# Altium schematic sheet Power block.SchDoc
size A4
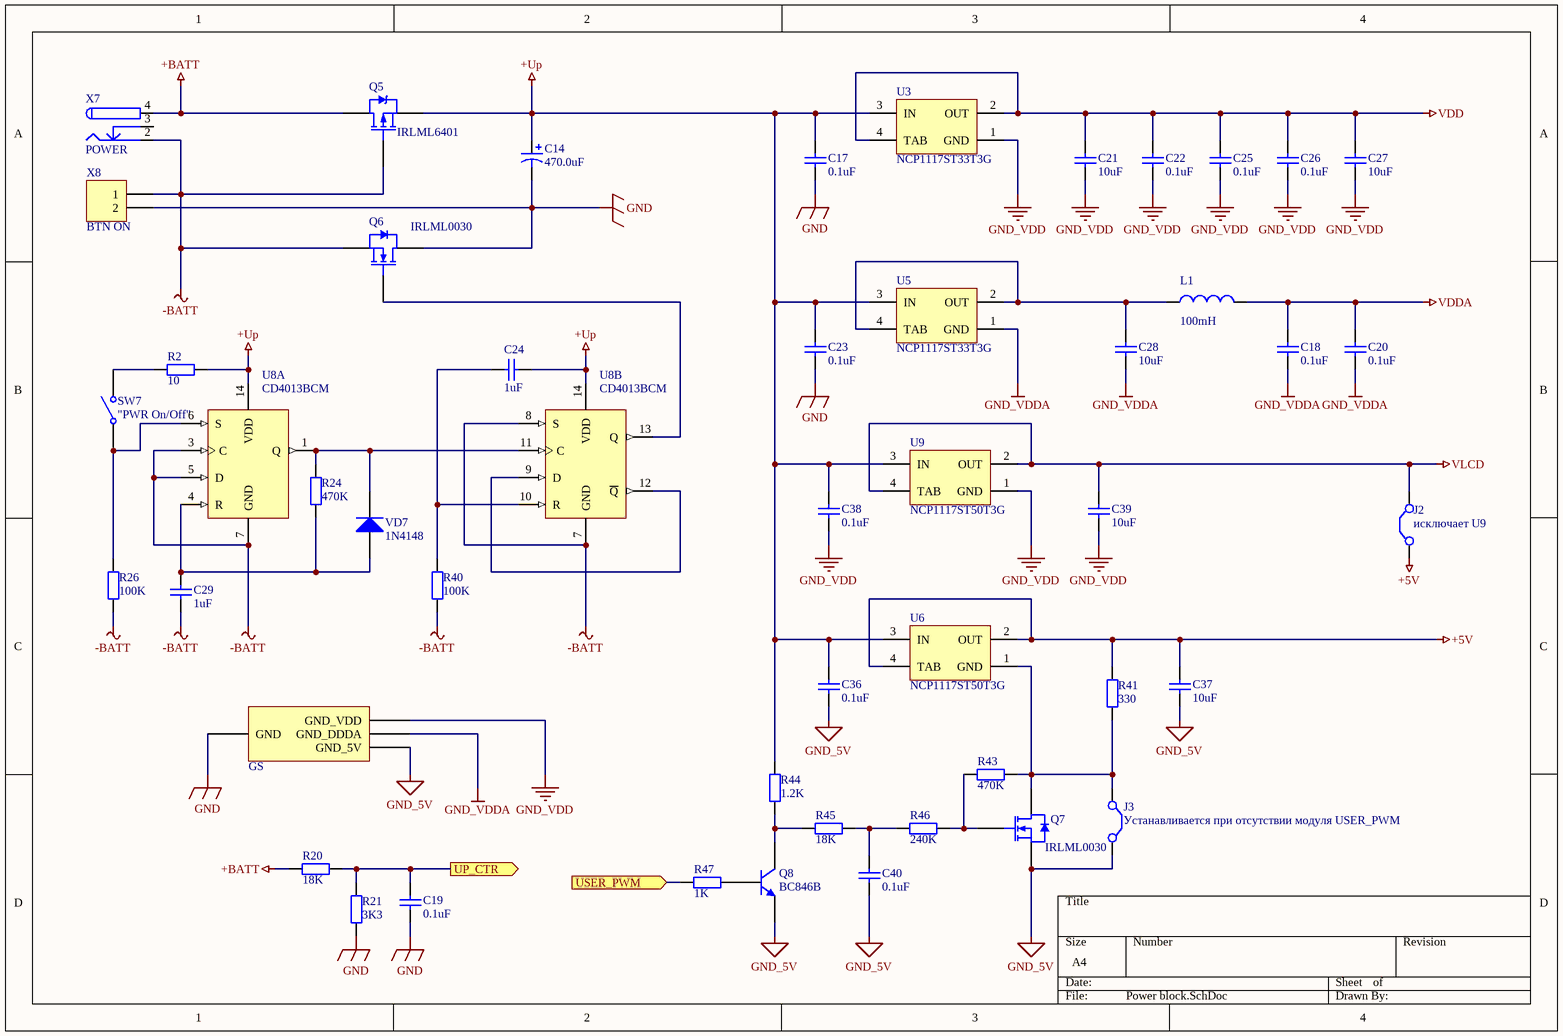
[diagram p0: Power block.SchDoc]

## Parts
C14  470.0uF  [Capacitor-10x12.5-lyingR]
C17  0.1uF  [1206_SMD_Capacitor]
C18  0.1uF  [1206_SMD_Capacitor]
C19  0.1uF  [1206_SMD_Capacitor]
C20  0.1uF  [1206_SMD_Capacitor]
C21  10uF  [1206_SMD_Capacitor]
C22  0.1uF  [0805]
C23  0.1uF  [1206_SMD_Capacitor]
C24  1uF  [1206_SMD_Capacitor]
C25  0.1uF  [0805]
C26  0.1uF  [0805]
C27  10uF  [1206_SMD_Capacitor]
C28  10uF  [1206_SMD_Capacitor]
C29  1uF  [1206_SMD_Capacitor]
C36  0.1uF  [1206_SMD_Capacitor]
C37  10uF  [1206_SMD_Capacitor]
C38  0.1uF  [1206_SMD_Capacitor]
C39  10uF  [1206_SMD_Capacitor]
C40  0.1uF  [1206_SMD_Capacitor]
GS  Ground setter  [GND_POINT]  (value not drawn)  (net tie, no BOM)
J2  исключает U9  [1206_SMD_JUMPER]
J3  Устанавливается при отсутствии модуля USER_PWM  [1206_SMD_Resistor]
L1  value 100mH  [1210]  (hidden comment: Inductor)
Q5  IRLML6401  [SOT23_N]
Q6  IRLML0030  [SOT23_N]
Q7  IRLML0030  [SOT23_N]
Q8  BC846B  [SOT23_N]
R2  10  [1206_SMD_Resistor]
R20  18K  [1206_SMD_Resistor]
R21  3K3  [1206_SMD_Resistor]
R24  470K  [1206_SMD_Resistor]
R26  100K  [1206_SMD_Resistor]
R40  100K  [1206_SMD_Resistor]
R41  330  [1206_SMD_Resistor]
R43  470K  [1206_SMD_Resistor]
R44  1.2K  [1206_SMD_Resistor]
R45  18K  [1206_SMD_Resistor]
R46  240K  [1206_SMD_Resistor]
R47  1K  [1206_SMD_Resistor]
SW7  "PWR On/Off"  [KAN1211]
U3  NCP1117ST33T3G  [SOT-223]
U5  NCP1117ST33T3G  [SOT-223]
U6  NCP1117ST50T3G  [SOT-223]
U8  CD4013BCM  [M14A_M]  (parts A,B of 2)
U9  NCP1117ST50T3G  [SOT-223]
VD7  1N4148  [SOD-323]
X7  POWER  [DC-044]
X8  BTN ON  [HDR1X2]

## Ports
UP_CTR (out), USER_PWM (in)

## Nets
+5V: C37.2 J2.1(C1) R41.2 U6.2(OUT) U6.4(TAB)
+BATT: Q5.3(D) R20.1 X7.4
+Up: C14.1 C17.2 C23.2 C24.2 C36.2 C38.2 Q5.2(S) R2.2 R44.2 U3.3(IN) U5.3(IN) U6.3(IN) U8.14(VDD) U9.3(IN)
-BATT: C29.1 Q5.1(G) Q6.2(S) R26.1 R40.1 U8.3(C) U8.5(D) U8.7(GND) U8.8(S) X7.2 X8.1
GND: C14.2 C17.1 C19.1 C23.1 GS.1(GND) Q6.3(D) R21.1 X8.2
GND_5V: C36.1 C37.1 C40.1 GS.4(GND_5V) J3.2(C2) Q7.2(S) Q8.2(E)
GND_VDD: C21.1 C22.1 C25.1 C26.1 C27.1 C38.1 C39.1 GS.2(GND_VDD) U3.1(GND) U9.1(GND)
GND_VDDA: C18.1 C20.1 C28.1 GS.3(GND_DDDA) U5.1(GND)
VDD: C21.2 C22.2 C25.2 C26.2 C27.2 U3.2(OUT) U3.4(TAB)
VDDA: C18.2 C20.2 L1.2
VLCD: C39.2 J2.2(C2) U9.2(OUT) U9.4(TAB)
UP_CTR: C19.2 R20.2 R21.2 ; port UP_CTR
USER_PWM: R47.1 ; port USER_PWM
NetC24_1: C24.1 R40.2 U8.10(R)
NetC28_2: C28.2 L1.1 U5.2(OUT) U5.4(TAB)
NetC29_2: C29.2 R24.1 U8.4(R) VD7.1(A)
NetC40_2: C40.2 R45.2 R46.1
NetJ3_1: J3.1(C1) Q7.3(D) R41.1 R43.1 U6.1(GND)
NetQ6_1: Q6.1(G) U8.13(Q)
NetQ7_1: Q7.1(G) R43.2 R46.2
NetQ8_1: Q8.1(B) R47.2
NetQ8_3: Q8.3(C) R44.1 R45.1
NetR2_1: R2.1 SW7.2(NO)
NetR24_2: R24.2 U8.1(Q) U8.11(C) VD7.2(K)
NetR26_2: R26.2 SW7.1(COMMON) U8.6(S)
NetU8_9: U8.9(D) U8.12(~{Q})

Not connected (* = marked no-connect by the designer): U8 2(~{Q}); X7 3

## Library data of the parts
C14 = Cap Pol1: Polarized Capacitor (Radial); Published: 8-Jun-2000; LatestRevisionDate: 17-Jul-2002; LatestRevisionNote: Re-released for DXP Platform.; PackageReference: RB7.6-15; Publisher: Altium Limited; PackageDescription: Polarized Capacitor (Radial); 2 Leads; Value: 470.0uF
C17-C29 C36-C40 = Capacitor SMD: Capacitor; Published: 8-Jun-2000; LatestRevisionDate: 17-Jul-2002; LatestRevisionNote: Re-released for DXP Platform.; PackageReference: RAD-0.3; Publisher: Altium Limited
  C17-C20 C22 C23 C25 C26 C36 C38 C40: Value: 0.1uF
  C21 C27 C28 C37 C39: Value: 10uF
  C24 C29: Value: 1uF
GS = Ground setter: pin to pad: 3>4 4>3
J2 J3 = Jumper: Jumper Wire; Published: 24-Mar-1999; LatestRevisionDate: 17-Jul-2002; LatestRevisionNote: Re-released for DXP Platform.; PackageReference: RAD-0.2; Publisher: Altium Limited; PackageDescription: Radial Cap, Thru-Hole; 2 Leads; 0.2 in Pin Spacing
L1 = Inductor: Code_IEC: 1005; Published: 8-Jun-2000; LatestRevisionDate: 29-May-2009; LatestRevisionNote: IPC-7351 Footprint Added.; PackageReference: 0402-A; Publisher: Altium Limited; PackageDescription: Chip Inductor; Code_JEITA: 0402
Q5 = IRLML6401: HEXFET Power MOSFET; Published: 17-Sep-2003; DatasheetVersion: 2-Jul-2001; PackageVersion: Jul-2001; PackageReference: Micro3; Publisher: Altium Limited; PackageDescription: 3-Pin SOT-23 Package 0.95 mm Pitch, 2.3 mm Lead Span; ComponentLink1Description: Manufacturer Link; ComponentLink1URL: http://www.irf.com/; ComponentLink2Description: Datasheet; ComponentLink2URL: http://www.irf.com/product-info/datasheets/data/IRLML6401.pdf
Q6 Q7 = 2N7002: HEXFET Power MOSFET; Published: 17-Sep-2003; DatasheetVersion: 2-Jul-2001; PackageVersion: Jul-2001; PackageReference: Micro3; Publisher: Altium Limited; PackageDescription: 3-Pin SOT-23 Package 0.95 mm Pitch, 2.3 mm Lead Span; ComponentLink1Description: Manufacturer Link; ComponentLink1URL: http://www.irf.com/; ComponentLink2Description: Datasheet; ComponentLink2URL: http://www.irf.com/product-info/datasheets/data/IRLML6401.pdf
Q8 = BC846B: NPN General-purpose Transistor; Published: 17-Sep-2003; LatestRevisionDate: 12-Dec-2006; LatestRevisionNote: IPC-7351 Footprint Added.; DatasheetVersion: 4-Feb-2002; PackageVersion: May-1999; PackageReference: SOT23; Publisher: Altium Limited; PackageDescription: 3-Pin SOT-23 Package 0.95 mm Pitch, 2.3 mm Lead Span; ComponentLink1Description: Manufacturer Link; ComponentLink1URL: http://www.semiconductors.philips.com/; ComponentLink2Description: Datasheet; ComponentLink2URL: http://www.semiconductors.philips.com/acrobat/datasheets/BC846_BC847_BC848_5.pdf
R2 R20 R21 R24 R26 R40 R41 R43-R47 = Resistor
  R2: Published: 31-Aug-2014; Publisher: Dmitry Kuzmin; Value: 10
  R20: Published: 8-Jun-2000; LatestRevisionDate: 17-Jul-2002; LatestRevisionNote: Re-released for DXP Platform.; PackageReference: AXIAL-0.4; Publisher: Altium Limited; PackageDescription: Axial Device, Thru-Hole; 2 Leads; 0.4 in Pin Spacing; Value: 18K
  R21: Published: 8-Jun-2000; LatestRevisionDate: 17-Jul-2002; LatestRevisionNote: Re-released for DXP Platform.; PackageReference: AXIAL-0.4; Publisher: Altium Limited; PackageDescription: Axial Device, Thru-Hole; 2 Leads; 0.4 in Pin Spacing; Value: 3K3
  R24 R43: Published: 31-Aug-2014; Publisher: Dmitry Kuzmin; Value: 470K
  R26 R40: Published: 31-Aug-2014; Publisher: Dmitry Kuzmin; Value: 100K
  R41: Published: 31-Aug-2014; Publisher: Dmitry Kuzmin; Value: 330
  R44: Published: 31-Aug-2014; Publisher: Dmitry Kuzmin; Value: 1.2K
  R45: Published: 31-Aug-2014; Publisher: Dmitry Kuzmin; Value: 18K
  R46: Published: 31-Aug-2014; Publisher: Dmitry Kuzmin; Value: 240K
  R47: Published: 31-Aug-2014; Publisher: Dmitry Kuzmin; Value: 1K
SW7 = TACT Switch: Single-Pole, Single-Throw Switch; Published: 24-Mar-1999; LatestRevisionDate: 17-Jul-2002; LatestRevisionNote: Re-released for DXP Platform.; PackageReference: SPST-2; Publisher: Altium Limited; PackageDescription: Switch; 2 Leads
U3 U5 = NCP1117ST33: LDO стабилизатор 3.3 V, 1 A, падение 1.2 V, Uвх до 20 V, 0..+125°C, 1%; PartNumber: LM1117S-3.3; Manufacturer: National Semiconductor; PackageTopMarking: NSUZXYTTE#*LM1117S*3.3; CompType: LDO IC; Published: 4-Dec-2008; DatasheetVersion: Apr-2006; PackageVersion: revF, Apr-2005; PackageReference: TS3B; Publisher: Altium Limited; PackageDescription: TO-263, Molded, .400 x .390 x .180in, 3 Lead, .1in Pitch, Surface Mount; Supplier 1: Farnell; Supplier Part Number 1: 1652366; RoHS: O; PinCount: 3; Code_JEDEC: MO-169-AA; ComponentLink1Description: LM1117 Datasheet; ComponentLink1URL: http://www.national.com/ds/LM/LM1117.pdf; ComponentLink2Description: LM1117 Web Page; ComponentLink2URL: http://www.national.com/pf/LM/LM1117.html; ComponentLink3Description: TS3B Package Page; ComponentLink3URL: http://www.national.com/packaging/folders/ts3b.html; Supplier 2: Digi-Key; Supplier Part Number 2: NCP1117ST33T3GOSTR-ND
U6 U9 = NCP1117ST50: LDO стабилизатор 5.0 V, 1 A, падение 1.2 V, Uвх до 20 V, 0..+125°C, 1%; PartNumber: LM1117S-5.0; Manufacturer: National Semiconductor; PackageTopMarking: NSUZXYTTE#*LM1117S*5.0; CompType: LDO IC; Published: 4-Dec-2008; DatasheetVersion: Apr-2006; PackageVersion: revF, Apr-2005; PackageReference: TS3B; Publisher: Altium Limited; PackageDescription: TO-263, Molded, .400 x .390 x .180in, 3 Lead, .1in Pitch, Surface Mount; RoHS: Y; PinCount: 3; Code_JEDEC: MO-169-AA; ComponentLink1Description: LM1117 Datasheet; ComponentLink1URL: http://www.national.com/ds/LM/LM1117.pdf; ComponentLink2Description: LM1117 Web Page; ComponentLink2URL: http://www.national.com/pf/LM/LM1117.html; ComponentLink3Description: TS3B Package Page; ComponentLink3URL: http://www.national.com/packaging/folders/ts3b.html; Supplier 1: Digi-Key; Supplier Part Number 1: NCP1117ST50T3GOSTR-ND
U8 = CD4013BCM: Dual D-Type Flip-Flop; Published: 17-Jul-2002; LatestRevisionDate: 13-Apr-2006; LatestRevisionNote: IPC-7351 Footprint Added.; DatasheetVersion: Jan-1999; PackageVersion: 2000; PackageReference: M14A; Publisher: Altium Limited; PackageDescription: 14-Pin Small Outline Integrated Circuit 1.27 mm Pitch; Code_IPC: SOIC127P600-14; ComponentLink1Description: Manufacturer Link; ComponentLink1URL: http://www.fairchildsemi.com/
VD7 = 1N4148: High Conductance Fast Diode; Published: 8-Jun-2000; LatestRevisionDate: 17-Jul-2002; LatestRevisionNote: Re-released for DXP Platform.; DatasheetDocument: 1997; PackageReference: DO-35; Publisher: Altium Limited; Code_JEDEC: DO-204-AH; ComponentLink1Description: Manufacturer Link; ComponentLink1URL: http://www.fairchildsemi.com/; ComponentLink2Description: Datasheet; ComponentLink2URL: http://www.fairchildsemi.com/ds/1N%2F1N4148.pdf
X7 = DC-044: Low Voltage Power Supply Connector; Published: 17-Dec-2003; DatasheetDocument: 09-May-2002; Publisher: Altium Limited; ComponentLink1Description: Manufacturer Link; ComponentLink1URL: http://domino.kycon.com/internet/Products.html
X8 = Header 2: Header, 2-Pin; LatestRevisionDate: 17-Jul-2002; LatestRevisionNote: Re-released for DXP Platform.; Publisher: Altium Limited